# EAGLE design TPIC6C (EAGLE 9.6.2)
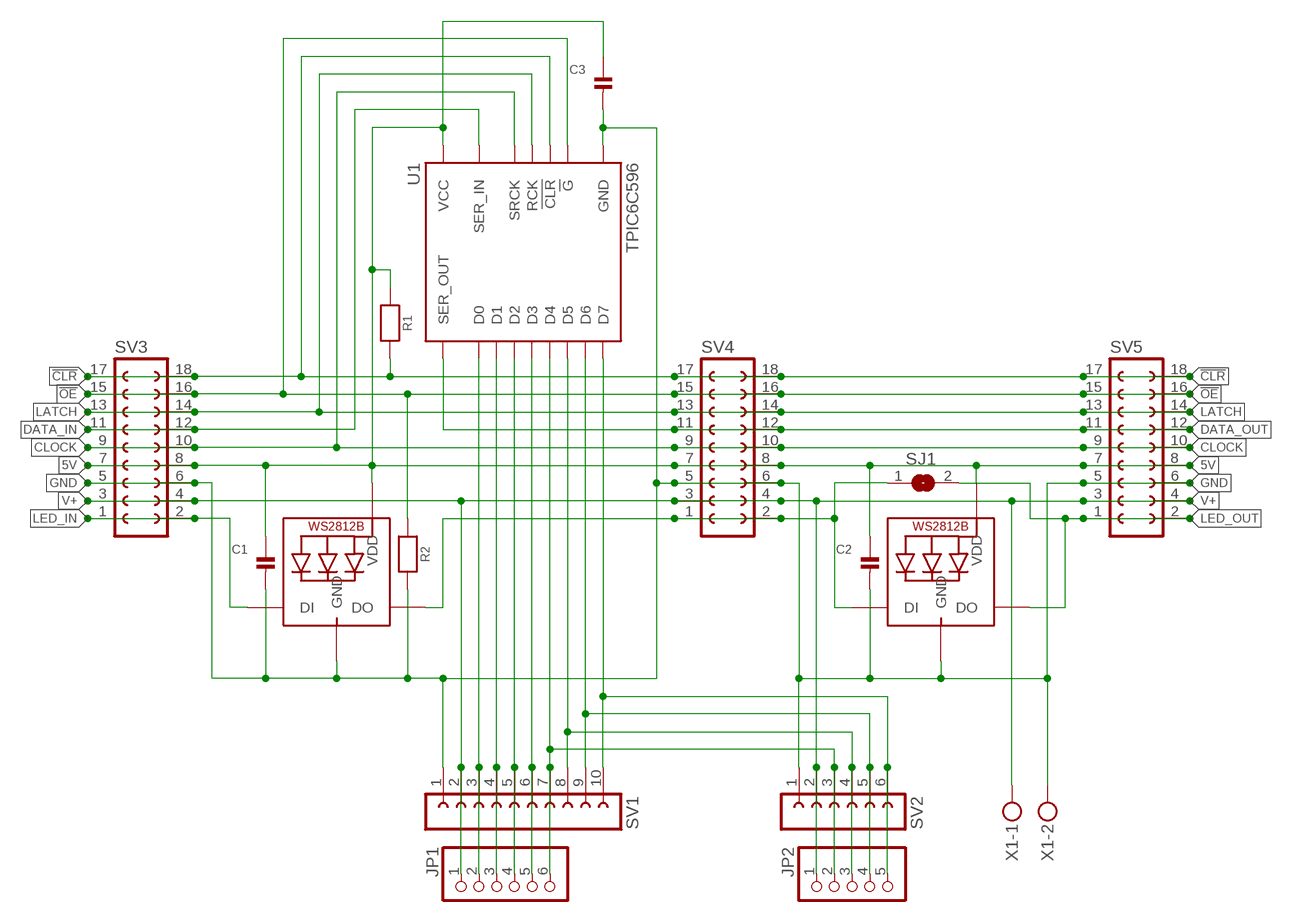
[diagram p0: schematic, sheet 1]

## Parts
C1  CAP_CERAMIC0603  [0603]
C2  CAP_CERAMIC0603  [0603]
C3  CAP_CERAMIC0603  [0603]
JP1  HEADER-1X61X06_1.27MM  [1X06_1.27MM]
JP2  HEADER-1X51.27MM  [1X05_1.27MM]
LED1  WS2812B5050  [WS2812B]
LED2  WS2812B5050  [WS2812B]
R1  MICROBUILDER_RESISTOR_0603_NOOUT  [MICROBUILDER_0603-NO]
R2  MICROBUILDER_RESISTOR_0603_NOOUT  [MICROBUILDER_0603-NO]
SJ1  SOLDERJUMPER  [SOLDERJUMPER_ARROW_NOPASTE]
SV1  FE10-1  [FE10]
SV2  FE06-1  [FE06]
SV3  FE09-2NOSILK  [FE09-2_NOSILK]
SV4  FE09-2NOSILK  [FE09-2_NOSILK]
SV5  FE09-2NOSILK  [FE09-2_NOSILK]
U1  TPIC6C596  TPIC6C596SOIC  [SO16]
X1  MKDSN1,5/2-5,08  [MKDSN1,5/2-5,08]

## Nets
5V: C1.1 C2.1 C3.1 LED1.1-VDD(VDD) LED2.1-VDD(VDD) R1.1 SV3.7 SV3.8 SV4.7 SV4.8 SV5.7 SV5.8 U1.1(VCC)
!CLR: R1.2 SV3.17 SV3.18 SV4.17 SV4.18 SV5.17 SV5.18 U1.7(!CLR)
!OE: R2.1 SV3.15 SV3.16 SV4.15 SV4.16 SV5.15 SV5.16 U1.8(!G)
CLOCK: SV3.9 SV3.10 SV4.9 SV4.10 SV5.9 SV5.10 U1.15(SRCK)
D0: JP1.2 SV1.3 U1.3(D0)
D1: JP1.3 SV1.4 U1.4(D1)
D2: JP1.4 SV1.5 U1.5(D2)
D3: JP1.5 SV1.6 U1.6(D3)
D4: JP1.6 JP2.2 SV1.7 SV2.3 U1.11(D4)
D5: JP2.3 SV1.8 SV2.4 U1.12(D5)
D6: JP2.4 SV1.9 SV2.5 U1.13(D6)
D7: JP2.5 SV1.10 SV2.6 U1.14(D7)
DATA_IN: SV3.11 SV3.12 U1.2(SER_IN)
DATA_OUT: SV4.11 SV4.12 SV5.11 SV5.12 U1.9(SER_OUT)
GND: C1.2 C2.2 C3.2 LED1.3-GND(GND) LED2.3-GND(GND) R2.2 SV1.1 SV2.1 SV3.5 SV3.6 SV4.5 SV4.6 SV5.5 SV5.6 U1.16(GND) X1.2
LATCH: SV3.13 SV3.14 SV4.13 SV4.14 SV5.13 SV5.14 U1.10(RCK)
LED_IN: LED1.4-DIN(DI) SV3.1 SV3.2
LED_OUT: LED2.2-DOUT(DO) SJ1.2 SV5.1 SV5.2
LED_OUT_IN: LED1.2-DOUT(DO) LED2.4-DIN(DI) SJ1.1 SV4.1 SV4.2
V+: JP1.1 JP2.1 SV1.2 SV2.2 SV3.3 SV3.4 SV4.3 SV4.4 SV5.3 SV5.4 X1.1

## Library data of the parts
C1-C3 = microbuilder:CAP_CERAMIC: Ceramic Capacitors 0402 - 0402 Surface Mount Capacitors 16pF 50V 5% [Digikey: 445-4899-2-ND] 18pF 50V 5% [Digikey: 490-1281-2-ND] 22pF 50V 5% [Digikey: 490-1283-2-ND] 68pF 50V 5% [Digikey: 490-1289-2-ND] 0.1uF 10V 10% [Digikey: 490-1318-2-ND] 1.0uF 6.3V 10% [Digikey: 490-1320-2-ND] 0603 - 0603 Surface Mount Capacitors 16 pF 50V 5% [Digikey: 445-5051-2-ND] 22 pF 50V [Digikey: PCC220ACVTR-ND] 33 pF 50V 5% [Digikey: 490-1415-1-ND] 56pF 50V 5% [Digikey: 490-1421-1-ND] 220pF 50V 5% [Digikey: 445-1285-1-ND] 680 pF 50V 2200 pF 50V 5% C0G [Digikey: 445-1297-1-ND] 5600 pF 100V 5% X7R [Digikey: 478-3711-1-ND] 0.1 µF 25V 10% [Digikey: PCC2277TR-ND] 0.22 µF 16V 10% X7R [Digikey: 445-1318-1-ND] 1.0 µF 25V 10% [Digikey: 445-5146-2-ND] 0603 - RF Specific 3pF 250V +/-0.1pF RF [Digikey: 712-1347-1-ND] 18 pF 250V 5% [Digikey: 478-3505-1-ND or 712-1322-1-ND] 56 pF 250V 5% C0G RF [Digikey: 490-4867-1-ND] 68 pF 250V RF [Digikey: 490-4868-1-ND] 0805 - 0805 Surface Mount Capacitors 220 pF 250V 2% RF Ceramic Capacitor [Digikey: 712-1398-1-ND] 1000 pF 50V 2% NP0 Ceramic Capacitor [Digikey: 478-3760-1-ND] 0.1 µF 25V 10% Ceramic Capacitor [Digikey: PCC1828TR-ND] 1.0 µF 16V 10% Ceramic Capacitor[Digikey: 490-1691-2-ND] 10.0 µF 10V 10% Ceramic Capacitor[Digikey: 709-1228-1-ND] 10.0 uF 16V 10% Ceramic Capacitor [Digikey: 478-5165-2-ND] 47 uF 6.3V 20% Ceramic Capacitor [Digikey: 587-1779-1-ND or 399-5506-1-ND] 1206 - 1206 Surface Mount Capacitors 47uF 10V 20% Ceramic Capacitor [Digikey: 490-5528-1-ND or 399-5508-1-ND or 445-6010-1-ND] 100uF 6.3V -20%, +80% Y5V Ceramic Capacitor (Digikey: 490-4512-1-ND, Mouser: 81-GRM31CF50J107ZE1L)
JP1 = microbuilder:HEADER-1X6: PIN HEADER
JP2 = microbuilder:HEADER-1X5: PIN HEADER
LED1 LED2 = adafruit:WS2812B
R1 R2 = Progger2 (3):MICROBUILDER_RESISTOR: Resistors For new designs, use the packages preceded by an '_' character since they are more reliable: The following footprints should be used on most boards: _0402 - Standard footprint for regular board layouts _0603 - Standard footprint for regular board layouts _0805 - Standard footprint for regular board layouts _1206 - Standard footprint for regular board layouts For extremely tight-pitch boards where space is at a premium, the following 'micro-pitch' footprints can be used (smaller pads, no silkscreen outline, etc.): _0402MP - Micro-pitch footprint for very dense/compact boards _0603MP - Micro-pitch footprint for very dense/compact boards _0805MP - Micro-pitch footprint for very dense/compact boards _1206MP - Micro-pitch footprint for very dense/compact boards
SJ1 = microbuilder_original:SOLDERJUMPER: SMD Solder JUMPER Solder the two pads together to create a connection, or remove the solder to break it. REFLOW - Use this footprint for solder paste and reflow ovens. WAVE - Use this footprint for hand-soldering (larger pads). CLOSED - Has a trace between the two pads to ensure it is closed by default. The trace needs to be cut to disable the jumper, and can be closed again by creating a solder bridge between the two pads.; BOM: EXCLUDE
SV1 = con-lsta_edit_2:FE10-1: FEMALE HEADER; OC_FARNELL: unknown; OC_NEWARK: unknown
SV2 = con-lsta_edit_2:FE06-1: FEMALE HEADER; OC_FARNELL: unknown; OC_NEWARK: unknown
SV3-SV5 = con-lsta_edit_2:FE09-2: FEMALE HEADER
U1 = SparkFun-IC-Logic:TPIC6C596: Serial in shift register with open collector outputs This can sink up to 100mA per channel Datasheet <https://cdn.sparkfun.com/datasheets/Widgets/TPIC6C596.pdf> SparkFun Products SparkFun Large Digit Driver <https://www.sparkfun.com/products/13279> (WIG-13279); PROD_ID: IC-12522
X1 = con-phoenix-508:MKDSN1,5/2-5,08: MKDSN 1,5/ 2-5,08 Printklemme Nennstrom: 13,5 A Nennspannung: 250 V Rastermaß: 5,08 mm Polzahl: 2 Anschlussart: Schraubanschluss Montage: Löten Anschlussrichtung Leiter/Platine: 0 ° Artikelnummer: 1729128 Source: http://eshop.phoenixcontact.com .. 1729128.pdf

## Board
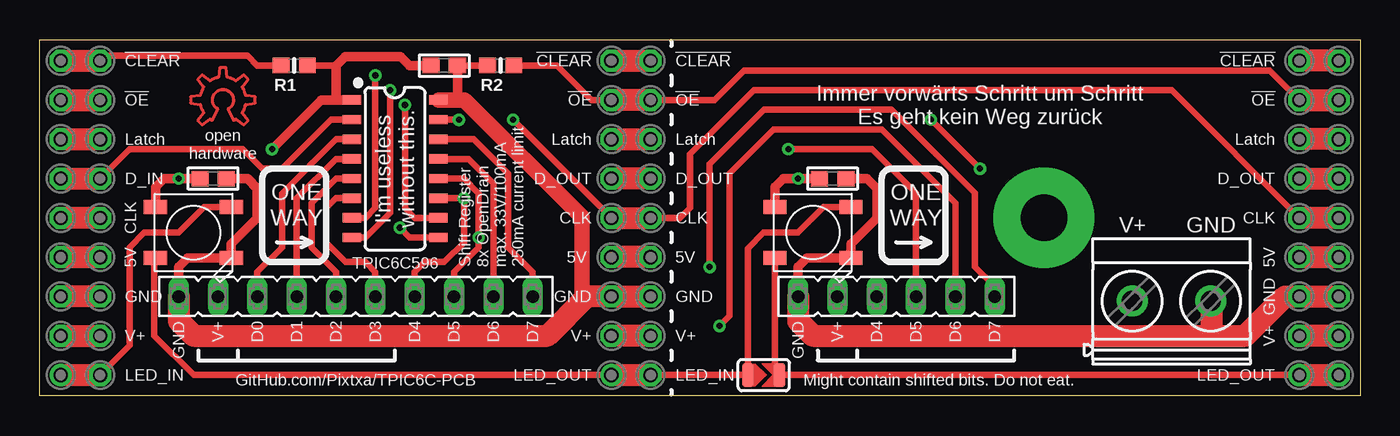
[diagram p1: board, top side]
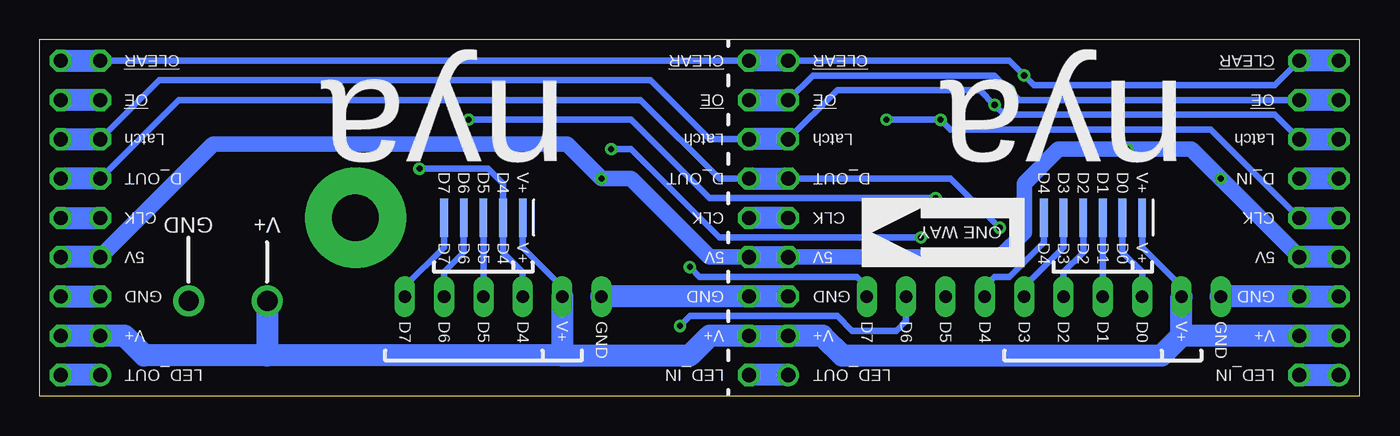
[diagram p2: board, bottom side, seen from below]

Size 85.28 x 23 mm. Coordinates in mm from the lower left corner, seen from the top.
Outline: 0,23 85.28,23 85.28,0 0,0 0,23
Copper layers (1*16): Top 0.035mm / dielectric 1.5mm / Bottom 0.035mm
Design rules "adafruit 88 *": minimum track width 8mil, minimum drill 15.5mil, track to track 8mil, track to pad 8mil, pad to pad 8mil, via to via 8mil, smd to smd 8mil, copper to edge 10mil, drill to drill 8mil, minimum pad ring 10mil, minimum via ring 8mil, stop-mask expansion 2mil, vias tented up to drill 20mil, thermal gap 10mil

### Footprints (pad centres in the part's own frame; a part is rotated, then mirrored left to right if it is on the bottom)
0603 = smd 1.1 x 1: 1 -0.85,0; 2 0.85,0
1X06_1.27MM = smd 0.5 x 2.5: 1 -3.175,0; 2 -1.905,0; 3 -0.635,0; 4 0.635,0; 5 1.905,0; 6 3.175,0
1X05_1.27MM = smd 0.5 x 2.5: 1 -2.54,0; 2 -1.27,0; 3 0,0; 4 1.27,0; 5 2.54,0
WS2812B = smd 1.5 x 0.9: 1-VDD 2.45,-1.65; 2-DOUT 2.45,1.65; 3-GND -2.45,1.65; 4-DIN -2.45,-1.65
MICROBUILDER_0603-NO = smd 1.075 x 1: 1 -0.85,0; 2 0.85,0
SOLDERJUMPER_ARROW_NOPASTE = smd 0.762 x 1.524: 1 -1.016,0; 2 1.016,0
FE10 = drill 0.813 long: 1 -11.43,0; 2 -8.89,0; 3 -6.35,0; 4 -3.81,0; 5 -1.27,0; 6 1.27,0; 7 3.81,0; 8 6.35,0; 9 8.89,0; 10 11.43,0
FE06 = drill 0.813 long: 1 -6.35,0; 2 -3.81,0; 3 -1.27,0; 4 1.27,0; 5 3.81,0; 6 6.35,0
FE09-2_NOSILK = drill 0.914: 1 -10.16,1.27 | drill 0.914 octagon: 2 -10.16,-1.27; 3 -7.62,1.27; 4 -7.62,-1.27; 5 -5.08,1.27; 6 -5.08,-1.27; 7 -2.54,1.27; 8 -2.54,-1.27; 9 0,1.27; 10 0,-1.27; 11 2.54,1.27; 12 2.54,-1.27; 13 5.08,1.27; 14 5.08,-1.27; 15 7.62,1.27; 16 7.62,-1.27; 17 10.16,1.27; 18 10.16,-1.27
SO16 = smd 0.6 x 1.2: 1 -4.445,-2.8; 2 -3.175,-2.8; 3 -1.905,-2.8; 4 -0.635,-2.8; 5 0.635,-2.8; 6 1.905,-2.8; 7 3.175,-2.8; 8 4.445,-2.8; 9 4.445,2.8; 10 3.175,2.8; 11 1.905,2.8; 12 0.635,2.8; 13 -0.635,2.8; 14 -1.905,2.8; 15 -3.175,2.8; 16 -4.445,2.8
MKDSN1,5/2-5,08 = drill 1.3 pad 2: 1 -2.561,0.025; 2 2.519,0.025

### Placement (x,y rotation side)
C1  11.18,14.04 0 top
C2  51.19,14.04 0 top
C3  26.11,21.34 0 top
JP1  17.21,11.5 180 bottom
JP2  56.58,11.5 180 bottom
LED1  9.91,10.55 180 top
LED2  49.92,10.55 180 top
R1  16.42,21.34 180 top
R2  29.76,21.34 180 top
SJ1  46.74,1.34 0 top
SV1  20.39,6.42 0 top
SV2  55.31,6.42 0 top
SV3  2.61,11.5 90 top
SV4  38.17,11.5 90 top
SV5  82.61,11.5 90 top
U1  22.93,14.68 270 top
X1  73.09,6.1 0 top

### Tracks (layer width: path | path; a pad name or v marks a point on that pad's centre or on a via)
5V  (via drill 0.39, 0.4 pad 0.8)
  Top 0.406: LED2.1-VDD | R1.1 19.12,21.34
  Top 0.61: v14.99,15.95 18.17,19.12 19.12,19.12 | C1.1 v8.96,14.04 8.01,14.04 7.46,13.5 LED1.1-VDD | LED2.1-VDD 47.46,13.5 48.01,14.04 v48.96,14.04 C2.1 | U1.1 19.12,19.12 | C3.1 23.88,21.34 23.3,21.92 19.7,21.92 19.12,21.34 19.12,19.12
  Top 1.422: SV3.7 SV3.8 | SV4.8 SV4.7 | SV5.7 SV5.8
  Bottom 1.016: SV3.8 v8.96,14.04 10.87,15.95 v14.99,15.95 19.44,15.95 21.66,13.72 21.66,10.55 23.25,8.96 SV4.7 | SV4.8 41.98,8.96 47.06,14.04 v48.96,14.04 51.19,16.26 74.04,16.26 SV5.7
  Bottom 1.422: SV3.7 SV3.8 | SV4.8 SV4.7 | SV5.7 SV5.8
!CLR  (via drill 0.4 pad 0.8)
  Top 0.406: U1.7 21.03,11.5 21.66,12.14 v21.66,20.71 | R1.2 14.04,21.34 13.41,21.98 4.2,21.98 SV3.18
  Top 1.422: SV3.17 SV3.18 | SV4.17 SV4.18 | SV5.18 SV5.17
  Bottom 0.406: SV3.18 5.47,20.07 21.03,20.07 v21.66,20.71 22.61,21.66 SV4.17 | SV4.18 SV5.17
  Bottom 1.422: SV3.17 SV3.18 | SV4.17 SV4.18 | SV5.18 SV5.17
!OE  (via drill 0.4 pad 0.8)
  Top 0.406: U1.8 21.03,10.23 22.61,11.82 v22.61,19.75 | SV4.16 43.57,19.12 45.47,21.03 79.44,21.03 SV5.15 | R2.1 33.41,21.34 35.63,19.12 SV4.15
  Top 1.422: SV3.15 SV3.16 | SV4.16 SV4.15 | SV5.15 SV5.16
  Bottom 0.406: SV3.16 21.98,19.12 v22.61,19.75 23.57,20.71 35.31,20.71 SV4.15
  Bottom 1.422: SV3.15 SV3.16 | SV4.16 SV4.15 | SV5.15 SV5.16
CLOCK  (via drill 0.39, 0.4 pad 0.8)
  Top 0.406: v27.06,17.85 U1.15 | v30.55,17.85 SV4.9 | SV4.10 41.34,11.5 41.98,12.14 41.98,15.63 46.11,19.75 73.08,19.75 SV5.9
  Top 1.422: SV3.10 SV3.9 | SV4.9 SV4.10 | SV5.10 SV5.9
  Bottom 0.406: SV3.10 9.6,17.21 26.42,17.21 v27.06,17.85 v30.55,17.85
  Bottom 1.422: SV3.10 SV3.9 | SV4.9 SV4.10 | SV5.10 SV5.9
D0
  Top 0.406: U1.3 19.12,16.58 15.63,13.09 15.63,9.6 14.04,8.01 SV1.3
  Bottom 0.406: SV1.3 14.04,8.01 15.31,9.28 JP1.2
D1
  Top 0.406: SV1.4 16.58,12.77 19.12,15.31 U1.4
  Bottom 0.406: JP1.3 SV1.4
D2
  Top 0.406: U1.5 19.12,14.04 17.53,12.45 17.53,9.6 19.12,8.01 SV1.5
  Bottom 0.406: SV1.5 19.12,8.01 17.85,9.28 JP1.4
D3
  Top 0.406: SV1.6 21.66,8.01 21.03,8.64 19.75,8.64 18.48,9.91 18.48,12.14 19.12,12.77 U1.6
  Bottom 0.406: SV1.6 21.66,7.06 19.12,9.6 JP1.5
D4  (via drill 0.39)
  Top 0.406: SV1.7 24.2,8.01 24.84,8.64 26.11,8.64 27.38,9.91 v27.38,12.77 U1.11 | v60.71,14.68 v57.54,17.85
  Bottom 0.406: v27.38,12.77 41.98,12.77 47.06,17.85 v57.54,17.85 | v60.71,14.68 56.27,14.68 55.31,13.72 JP2.2 55.31,9.28 54.04,8 SV2.3 | JP1.6 20.39,9.91 22.61,7.69 23.57,7.69 24.2,7.06 SV1.7
D5  (via drill 0.39)
  Top 0.406: U1.12 27.38,14.04 28.33,13.09 v28.33,10.23 28.33,9.6 26.74,8.01 SV1.8 | SV2.4 56.58,13.09 53.73,15.95 v48.33,15.95
  Bottom 0.406: v28.33,10.23 41.34,10.23 47.06,15.95 v48.33,15.95 | JP2.3 SV2.4
D6  (via drill 0.39)
  Top 0.406: SV1.9 29.28,13.72 27.69,15.31 U1.13 | v43.88,4.51 44.52,5.15 44.52,14.36 47.38,17.21 54.36,17.21 59.12,12.46 SV2.5
  Bottom 0.406: SV1.9 29.28,4.83 29.91,4.2 32.77,4.2 33.72,5.15 43.25,5.15 v43.88,4.51 | JP2.4 57.85,9.28 59.12,8.01 SV2.5
D7  (via drill 0.39)
  Top 0.406: U1.14 28.01,16.58 30.23,14.36 30.23,9.6 31.82,8.01 SV1.10 | SV2.6 61.66,7.06 60.39,8.33 60.39,13.09 55,18.48 46.74,18.48 43.25,14.99 v43.25,8.33
  Bottom 0.406: SV1.10 31.82,7.06 32.45,7.69 42.61,7.69 v43.25,8.33 | JP2.5 59.12,9.6 61.66,7.06 SV2.6
DATA_IN
  Top 0.406: U1.2 18.8,17.85 15.63,14.68 14.36,14.68 13.09,15.95 5.79,15.95 SV3.12
  Top 1.422: SV3.11 SV3.12
  Bottom 1.422: SV3.11 SV3.12
DATA_OUT  (via drill 0.4 pad 0.8)
  Top 0.406: v23.25,10.87 23.88,10.23 U1.9
  Top 1.422: SV4.12 SV4.11 | SV5.11 SV5.12
  Bottom 0.406: v23.25,10.87 26.42,14.04 SV4.11 | SV4.12 41.34,14.04 46.42,19.12 76.26,19.12 SV5.11
  Bottom 1.422: SV4.12 SV4.11 | SV5.11 SV5.12
GND
  Top 0.203: X1.2 75.63,6.11
  Top 0.406: 49.53,8.9 | C3.2 R2.2
  Top 0.61: SV1.1 8.96,8.33 9.53,8.9 LED1.3-GND 12.36,9.82 14.04,11.5 14.04,13.41 13.41,14.04 C1.2 | 49.53,8.9 48.96,8.33 SV2.1 | 49.53,8.9 LED2.3-GND 52.37,9.83 54.04,11.5 54.04,13.41 53.4,14.04 C2.2 | C3.2 26.96,19.12
  Top 1.016: 35.31,6.42 34.99,6.42 34.99,11.56 27.43,19.12 26.96,19.12 U1.16
  Top 1.422: SV2.1 48.96,4.84 49.92,3.88 75.63,3.88 | SV1.1 8.96,4.83 9.91,3.88 32.77,3.88 35.31,6.42 SV4.5 SV4.6 | SV3.6 SV3.5 | 75.63,3.88 77.86,3.88 80.4,6.42 SV5.5 SV5.6 | 75.63,6.11 75.63,3.88
  Bottom 1.422: SV1.1 SV3.6 SV3.5 | SV2.1 SV4.6 SV4.5 | SV5.6 SV5.5
LATCH  (via drill 0.4 pad 0.8)
  Top 0.406: U1.10 24.2,11.5 23.57,12.14 v23.57,18.8
  Top 1.422: SV3.13 SV3.14 | SV4.13 SV4.14 | SV5.14 SV5.13
  Bottom 0.406: SV3.14 5.47,18.17 22.93,18.17 v23.57,18.8 24.52,19.75 33.72,19.75 SV4.13 | SV4.14 41.98,16.58 45.79,20.39 77.53,20.39 SV5.13
  Bottom 1.422: SV3.14 SV3.13 | SV4.13 SV4.14 | SV5.14 SV5.13
LED_IN
  Top 0.406: SV3.2 5.79,3.25 5.79,9.6 6.74,10.55 8.96,10.55 10.61,12.2 LED1.4-DIN
  Top 1.422: SV3.1 SV3.2
  Bottom 1.422: SV3.2 SV3.1
LED_OUT
  Top 0.406: SV5.1 SJ1.2 47.47,1.63 LED2.2-DOUT
  Top 1.422: SV5.1 SV5.2
  Bottom 1.422: SV5.1 SV5.2
LED_OUT_IN
  Top 0.406: LED1.2-DOUT 7.37,8.81 7.37,3.88 9.91,1.34 SV4.1 | LED2.4-DIN 50.61,12.2 48.96,10.55 46.74,10.55 45.73,9.54 SJ1.1 38.49,1.34
  Top 1.422: SV4.1 38.49,1.34 SV4.2
  Bottom 1.422: SV4.1 SV4.2
N$1  (via drill 3 pad 6.5)
  other vias: 64.84,11.5
N$2
  Top 0.203: 12.51,17.8 arc7 12.65,17.88 13.15,17.5 13.44,17.78 13.05,18.29 arc23 13.28,18.84 13.91,18.92 13.91,19.32 13.28,19.4 arc23 13.05,19.95 13.44,20.46 13.15,20.74 12.65,20.36 arc23 12.1,20.58 12.02,21.21 11.62,21.21 11.53,20.58 arc23 10.98,20.36 10.48,20.74 10.2,20.46 10.58,19.95 arc23 10.36,19.4 9.73,19.32 9.73,18.92 10.36,18.84 arc23 10.58,18.29 10.2,17.78 10.48,17.5 10.98,17.88 arc7 11.13,17.8 11.51,18.52 arc-63 11.14,19.12 arc-243 12.13,18.52 12.51,17.8
V+
  Top 1.422: SV3.3 SV3.4 | SV4.4 SV4.3 | SV5.4 SV5.3
  Bottom 0.203: X1.1 70.55,6.11
  Bottom 0.406: JP2.1 54.04,9.59 51.5,7.05 SV2.2 | SV1.2 11.5,7.06 14.04,9.6 JP1.1
  Bottom 1.422: 11.5,3.88 SV3.4 SV3.3 | 11.5,3.88 SV1.2 | 51.5,2.61 43.25,2.61 41.98,3.88 SV4.4 SV4.3 34.68,3.88 33.41,2.61 12.77,2.61 11.5,3.88 | SV2.2 51.5,2.61 | 51.5,2.61 70.55,2.61 | 70.55,2.61 78.49,2.61 79.76,3.88 SV5.3 SV5.4 | 70.55,6.11 70.55,2.61

### Text on the board
tPlace: !CLEAR | !CLEAR | !CLEAR | !CLEAR | !OE | !OE | !OE | Immer vorwärts Schritt um Schritt / Es geht kein Weg zurück | !OE | Latch | open / hardware | Latch | Latch | Latch | I'm useless / without this. | D_IN | ONE / WAY | D_OUT | D_OUT | ONE / WAY | D_OUT | CLK | CLK | CLK | CLK | V+ | GND | 5V | TPIC6C596 | Shift Register / 8x OpenDrain / max. 33V/100mA / 250mA current limit | 5V | 5V | 5V | GND | GND | GND | GND | GND | V+ | D0 | D1 | D2 | D3 | D4 | D5 | D6 | D7 | GND | V+ | D4 | D5 | D6 | D7 | V+ | V+ | V+ | V+ | LED_IN | LED_OUT | LED_IN | LED_OUT | GitHub.com/Pixtxa/TPIC6C-PCB | Might contain shifted bits. Do not eat.
bPlace: !CLEAR | !CLEAR | !CLEAR | !CLEAR | !OE | !OE | !OE | !OE | Latch | nya | Latch | Latch | nya | Latch | D_IN | D_OUT | D_OUT | D_OUT | V+ | D0 | D1 | D2 | D3 | D4 | V+ | D4 | D5 | D6 | D7 | CLK | CLK | CLK | CLK | ONE WAY | V+ | GND | V+ | D0 | D1 | D2 | D3 | D4 | V+ | D4 | D5 | D6 | D7 | 5V | 5V | 5V | 5V | GND | GND | GND | GND | GND | V+ | D0 | D1 | D2 | D3 | D4 | D5 | D6 | D7 | GND | V+ | D4 | D5 | D6 | D7 | V+ | V+ | V+ | V+ | LED_IN | LED_OUT | LED_IN | LED_OUT